# EasyEDA Pro project board.epro

# Schematic Schematic1
Board Name: Board1; Create Date: 2026-04-13; Page Name: P1; Project Name: kbdthing; Schematic Name: Schematic1; Update Date: 2026-05-21; Company: EasyEDA.com; Page Size: A4; Version: V1.0
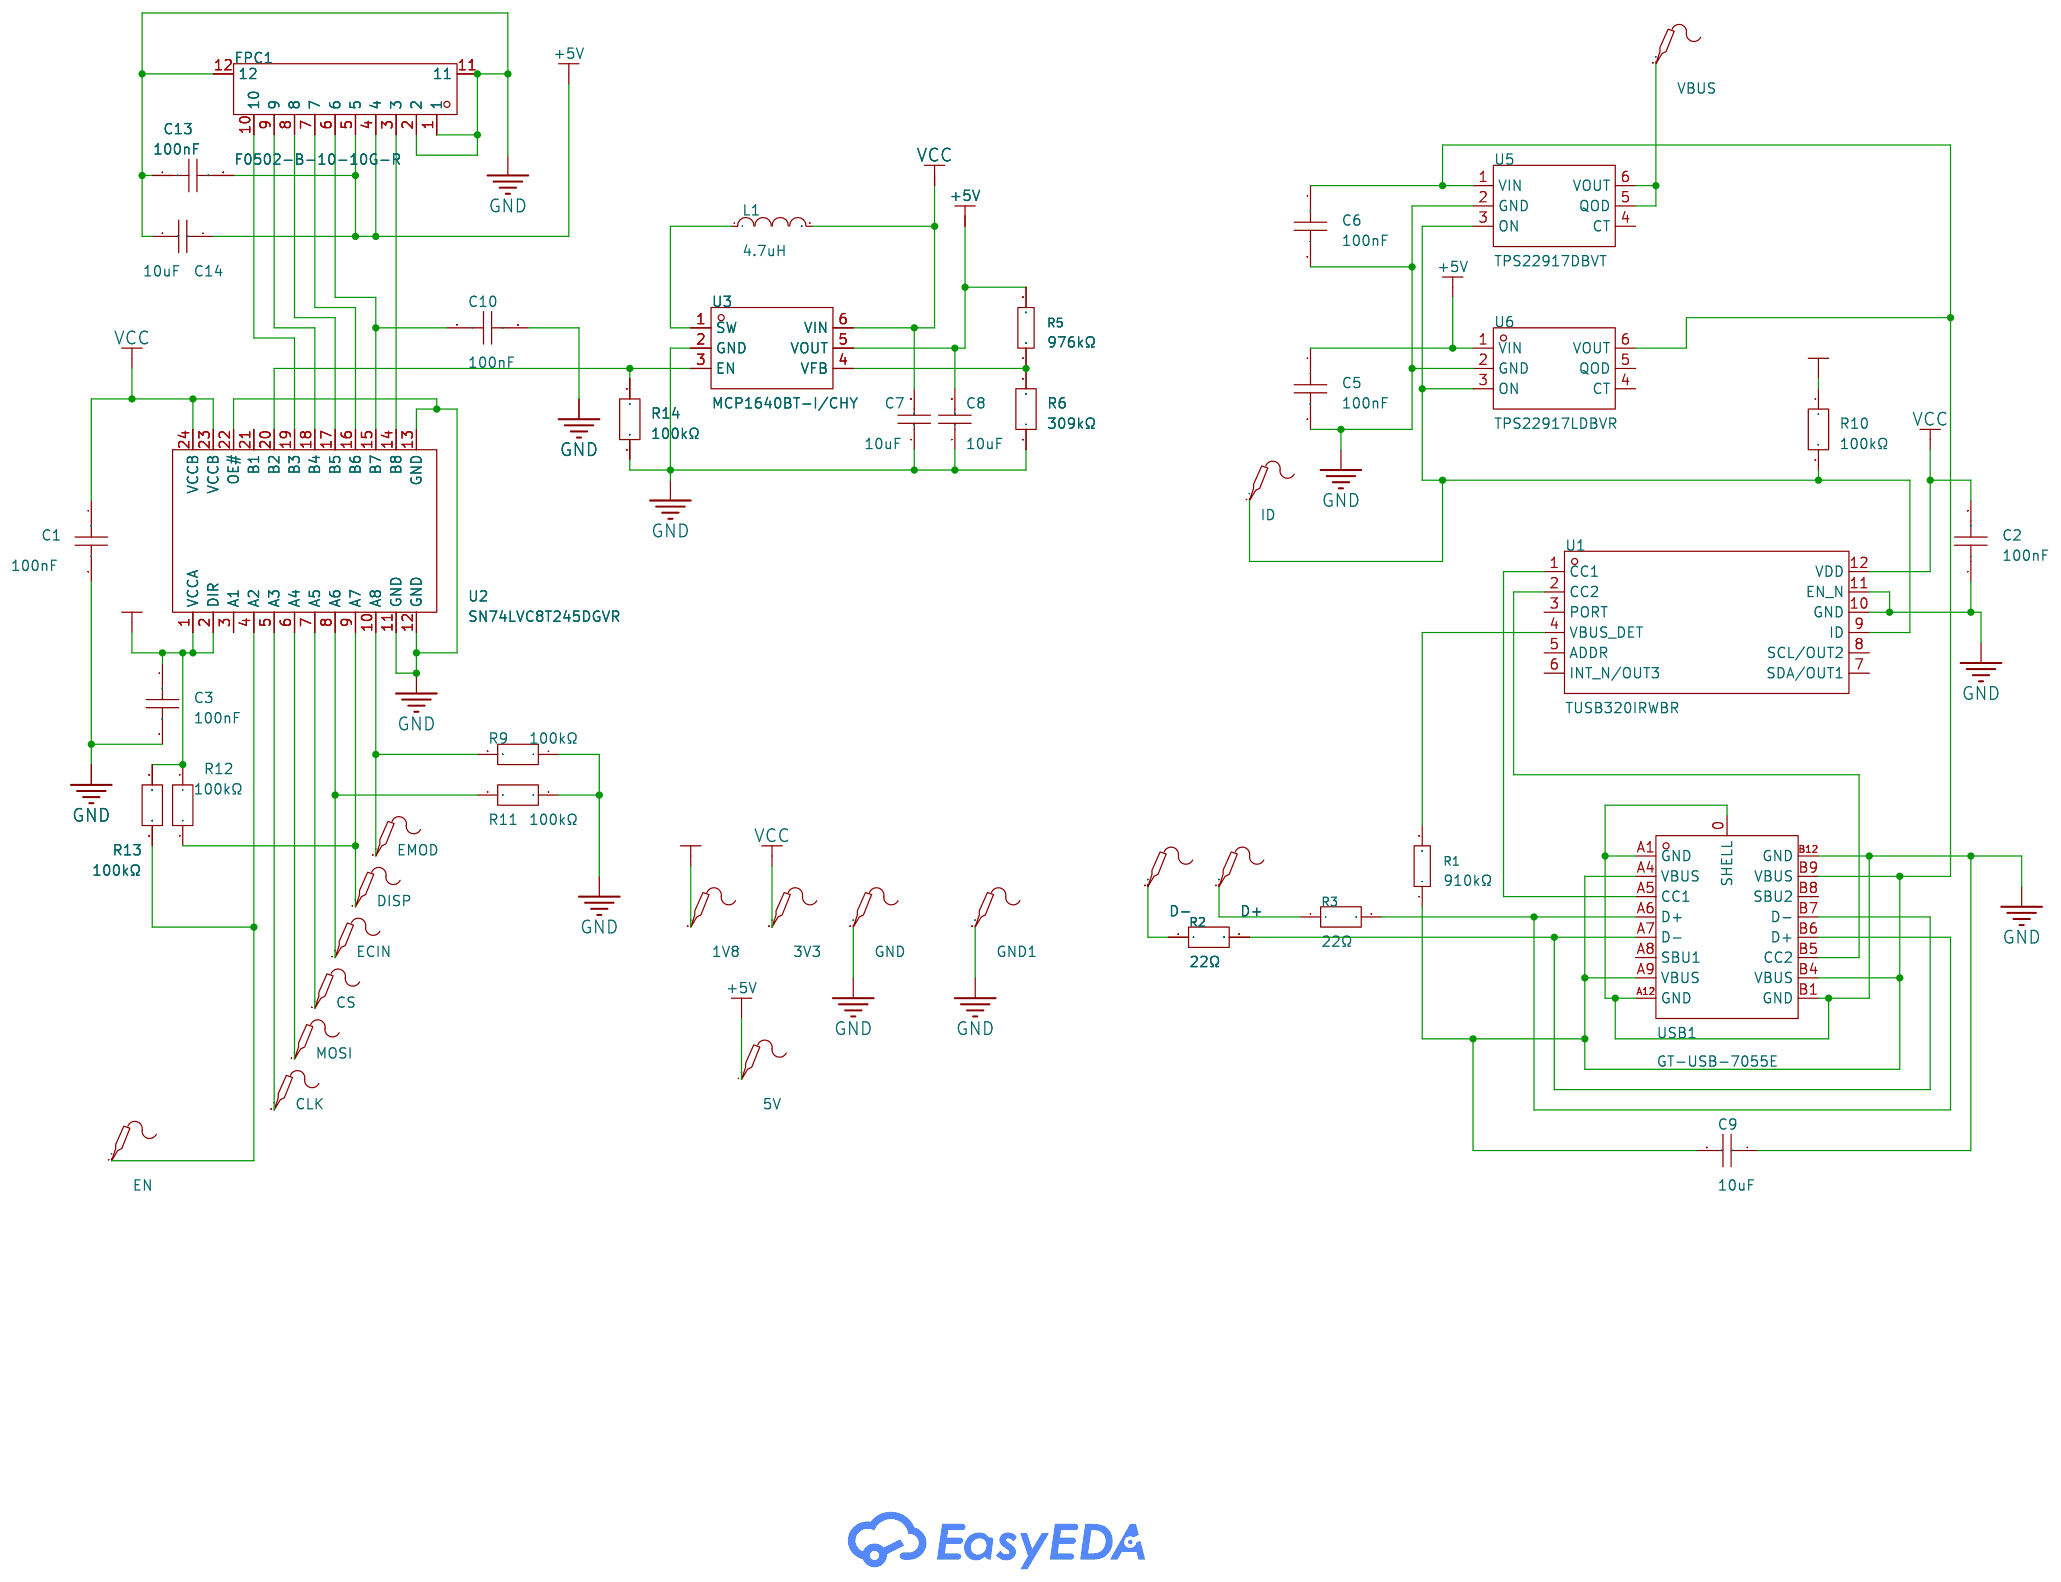
[diagram p0: schematic sheet]

## Parts
1V8  -  [TESTPOINT-SMD_1P-BD1.0-H5.5]
3V3  -  [TESTPOINT-SMD_1P-BD1.0-H5.5]
5V  -  [TESTPOINT-SMD_1P-BD1.0-H5.5]
C1  100nF  [C0402]
C2  100nF  [C0402]
C3  100nF  [C0402]
C5  100nF  [C0402]
C6  100nF  [C0402]
C7  10uF  [C0402]
C8  10uF  [C0402]
C9  10uF  [C0402]
C10  100nF  [C0402]
C13  100nF  [C0402]
C14  10uF  [C0402]
CLK  -  [TESTPOINT-SMD_1P-BD1.0-H5.5]
CS  -  [TESTPOINT-SMD_1P-BD1.0-H5.5]
D+  -  [TESTPOINT-SMD_1P-BD1.0-H5.5]
D-  -  [TESTPOINT-SMD_1P-BD1.0-H5.5]
DISP  -  [TESTPOINT-SMD_1P-BD1.0-H5.5]
ECIN  -  [TESTPOINT-SMD_1P-BD1.0-H5.5]
EMOD  -  [TESTPOINT-SMD_1P-BD1.0-H5.5]
EN  -  [TESTPOINT-SMD_1P-BD1.0-H5.5]
FPC1  F0502-B-10-10G-R  [FPC-SMD_F0502-B-10-10G-R]
GND  -  [TESTPOINT-SMD_1P-BD1.0-H5.5]
GND1  -  [TESTPOINT-SMD_1P-BD1.0-H5.5]
ID  -  [TESTPOINT-SMD_1P-BD1.0-H5.5]
L1  4.7uH  [IND-SMD_L4.0-W4.0_FNR40XXS]
MOSI  -  [TESTPOINT-SMD_1P-BD1.0-H5.5]
R1  910kΩ  [R0402]
R2  22Ω  [R0402]
R3  22Ω  [R0402]
R5  976kΩ  [R0402]
R6  309kΩ  [R0402]
R9  100kΩ  [R0402]
R10  100kΩ  [R0402]
R11  100kΩ  [R0402]
R12  100kΩ  [R0402]
R13  100kΩ  [R0402]
R14  100kΩ  [R0402]
U1  TUSB320IRWBR  [X2QFN-12_L1.6-W1.6-P0.40-TL]
U2  SN74LVC8T245DGVR  [TVSOP-24_L5.0-W4.4-P0.40-LS6.4-BL]
U3  MCP1640BT-I/CHY  [SOT-23-6_L2.9-W1.6-P0.95-LS2.8-BR]
U5  TPS22917DBVT  [SOT-23-6_L2.9-W1.6-P0.95-LS2.8-BR]
U6  TPS22917LDBVR  [SOT-23-6_L2.9-W1.6-P0.95-LS2.8-BR]
USB1  GT-USB-7055E  [USB-C-SMD_GT-USB-7055E]
VBUS  -  [TESTPOINT-SMD_1P-BD1.0-H5.5]

## Library data of the parts
1V8 3V3 5V CLK CS D+ D- DISP ECIN EMOD EN GND GND1 ID MOSI VBUS = Test-Point: Test Point 测试点; Check: false
C1-C3 C5 C6 C10 C13 = CL05B104KO5NNNC: Capacitance:100nF Tolerance:±10% Tolerance:±10% Voltage Rating:16V Temperature Coefficient:X7R; LCSC Part Name: 100nF ±10% 16V; Supplier Part: C1525; Manufacturer: SAMSUNG(三星); Supplier Footprint: 0402; JLCPCB Part Class: Basic Part; Datasheet: https://item.szlcsc.com/datasheet/CL05B104KO5NNNC/1877.html; Supplier: LCSC; Tolerance: ±10%; Voltage Rating: 16V; Temperature Coefficient: X7R
C7-C9 C14 = CL05A106MQ5NUNC: Capacitance:10uF Tolerance:±20% Tolerance:±20% Voltage Rating:6.3V Temperature Coefficient:X5R; LCSC Part Name: 10uF ±20% 6.3V; Supplier Part: C15525; Manufacturer: SAMSUNG(三星); Supplier Footprint: 0402; JLCPCB Part Class: Basic Part; Datasheet: https://item.szlcsc.com/datasheet/CL05A106MQ5NUNC/16204.html; Supplier: LCSC; Tolerance: ±20%; Voltage Rating: 6.3V; Temperature Coefficient: X5R
FPC1 = F0502-B-10-10G-R: Locking Feature:Hinged Lid Contact Type:Bottom Contact Number of Contacts:10P Pitch:0.5mm Mounting Type:Surface Mount, Right Angle FFC, FCB Thickness:0.3mm FFC, FCB Thickness:0.3mm Height Above Board:1mm Contact Material:Phosphor Bronze Contact Plating:Ti; LCSC Part Name: 翻盖式 下接 P数:10P 间距:0.5mm; Supplier Part: C512912; Manufacturer: XFCN(兴飞); Supplier Footprint: SMD,P=0.5mm,卧贴; JLCPCB Part Class: Extended Part; Datasheet: https://item.szlcsc.com/datasheet/F0502-B-10-10G-R/528193.html; Supplier: LCSC; Locking Feature: Hinged Lid; Contact Type: Bottom Contact; Number of Contacts: 10P; Pitch: 0.5mm; Mounting Type: Surface Mount, Right Angle; FFC, FCB Thickness: 0.3mm; Height Above Board: 1mm; Contact Material: Phosphor Bronze; Contact Plating: Tin; Operating Temperature: -25℃~+85℃; Rated Voltage (Max): 50V; Current Rating (Max): 400mA
L1 = FNR4030S4R7MT: Inductance:4.7uH Tolerance:±20% Tolerance:±20% Current Rating:2.3A Current - Saturation(Isat):3.2A DC Resistance(DCR):78mΩ Type:Magnetic Core Shielded Winding Alloy Inductor; LCSC Part Name: 4.7uH ±20% 3.2A; Supplier Part: C167874; Manufacturer: cjiang(长江微电); Supplier Footprint: SMD,4x4mm; JLCPCB Part Class: Extended Part; Datasheet: https://atta.szlcsc.com/upload/public/pdf/source/20190327/C167925_9EFF0AABC4CA629C2CC95961DBF7D39D.pdf; Supplier: LCSC; Tolerance: ±20%; Current Rating: 2.3A; Current - Saturation(Isat): 3.2A; DC Resistance(DCR): 78mΩ; Type: Magnetic Core Shielded Winding Alloy Inductor
R1 = 0402WGF9103TCE: Type:Thick Film Resistor Resistance:910kΩ Tolerance:±1% Tolerance:±1% Power(Watts):62.5mW Voltage-Supply(Max):50V Temperature Coefficient:±100ppm/℃ Temperature Coefficient:±100ppm/℃ Operating Temperature:-55℃~+155℃ Operating Temperature:-55℃~+155℃; LCSC Part Name: 910kΩ ±1% 62.5mW 厚膜电阻; Supplier Part: C25800; Manufacturer: UNI-ROYAL(厚声); Supplier Footprint: 0402; JLCPCB Part Class: Extended Part; Datasheet: https://item.szlcsc.com/datasheet/0402WGF9103TCE/26543.html; Supplier: LCSC; Type: Thick Film Resistor; Tolerance: ±1%; Power(Watts): 62.5mW; Voltage-Supply(Max): 50V; Temperature Coefficient: ±100ppm/℃; Operating Temperature: -55℃~+155℃
R2 R3 = FRC0402J220 TS: Type:Thick Film Resistor Resistance:22Ω Tolerance:±5% Tolerance:±5% Power(Watts):62.5mW Voltage-Supply(Max):50V Temperature Coefficient:±100ppm/℃ Temperature Coefficient:±100ppm/℃ Operating Temperature:-55℃~+155℃ Operating Temperature:-55℃~+155℃; LCSC Part Name: 22Ω ±5% 62.5mW 厚膜电阻; Supplier Part: C2906914; Manufacturer: FOJAN(富捷); Supplier Footprint: 0402; JLCPCB Part Class: Extended Part; Datasheet: https://item.szlcsc.com/datasheet/FRC0402J220%2520TS/3180427.html; Supplier: LCSC; Type: Thick Film Resistor; Tolerance: ±5%; Power(Watts): 62.5mW; Voltage-Supply(Max): 50V; Temperature Coefficient: ±100ppm/℃; Operating Temperature: -55℃~+155℃
R5 = 0402WGF9763TCE: Type:Thick Film Resistor Resistance:976kΩ Tolerance:±1% Tolerance:±1% Power(Watts):62.5mW Voltage-Supply(Max):50V Temperature Coefficient:±100ppm/℃ Temperature Coefficient:±100ppm/℃ Operating Temperature:-55℃~+155℃ Operating Temperature:-55℃~+155℃; LCSC Part Name: 976kΩ ±1% 62.5mW 厚膜电阻; Supplier Part: C25802; Manufacturer: UNI-ROYAL(厚声); Supplier Footprint: 0402; JLCPCB Part Class: Extended Part; Datasheet: https://item.szlcsc.com/datasheet/0402WGF9763TCE/26545.html; Supplier: LCSC; Type: Thick Film Resistor; Tolerance: ±1%; Power(Watts): 62.5mW; Voltage-Supply(Max): 50V; Temperature Coefficient: ±100ppm/℃; Operating Temperature: -55℃~+155℃
R6 = FRC0402F3093TS: Type:Thick Film Resistor Resistance:309kΩ Tolerance:±1% Tolerance:±1% Power(Watts):62.5mW Voltage-Supply(Max):50V Temperature Coefficient:±100ppm/℃ Temperature Coefficient:±100ppm/℃ Operating Temperature:-55℃~+155℃ Operating Temperature:-55℃~+155℃; LCSC Part Name: 309kΩ ±1% 62.5mW 厚膜电阻; Supplier Part: C5713270; Manufacturer: FOJAN(富捷); Supplier Footprint: 0402; JLCPCB Part Class: Extended Part; Supplier: LCSC; Type: Thick Film Resistor; Tolerance: ±1%; Power(Watts): 62.5mW; Voltage-Supply(Max): 50V; Temperature Coefficient: ±100ppm/℃; Operating Temperature: -55℃~+155℃
R9-R14 = FRC0402F1003TS: Type:Thick Film Resistor Resistance:100kΩ Tolerance:±1% Tolerance:±1% Power(Watts):62.5mW Voltage-Supply(Max):50V Temperature Coefficient:±100ppm/℃ Temperature Coefficient:±100ppm/℃ Operating Temperature:-55℃~+155℃ Operating Temperature:-55℃~+155℃; LCSC Part Name: 100kΩ ±1% 62.5mW 厚膜电阻; Supplier Part: C2906859; Manufacturer: FOJAN(富捷); Supplier Footprint: 0402; JLCPCB Part Class: Extended Part; Supplier: LCSC; Type: Thick Film Resistor; Tolerance: ±1%; Power(Watts): 62.5mW; Voltage-Supply(Max): 50V; Temperature Coefficient: ±100ppm/℃; Operating Temperature: -55℃~+155℃
U1 = TUSB320IRWBR: Interface:I2C；GPIO Data Rate:- Voltage - Supply:2.7V~5V Voltage - Supply:2.7V~5V Operating Temperature:-40℃~+85℃ Operating Temperature:-40℃~+85℃ Supply Current:100uA Quiescent Supply Current:100uA Features:-; LCSC Part Name: TUSB320 USB Type-C配置通道逻辑和端口控制; Supplier Part: C80170; Manufacturer: TI(德州仪器); Supplier Footprint: X2-QFN-12(1.6x1.6); JLCPCB Part Class: Extended Part; Datasheet: https://www.ti.com/cn/lit/gpn/tusb320; Supplier: LCSC; Interface: I2C；GPIO; Voltage - Supply: 2.7V~5V; Operating Temperature: -40℃~+85℃; Supply Current: 100uA; Quiescent Supply Current: 100uA
U2 = SN74LVC8T245DGVR: Channel Type:Bidirectional Voltage - Supply(VCCA):1.65V~5.5V Voltage - Supply(VCCA):1.65V~5.5V Voltage - Supply(VCCB):1.65V~5.5V Voltage - Supply(VCCB):1.65V~5.5V Number of Circuits:8 Output Type:Tri-State Operating Temperature:-40℃~+85℃ Operating Tempera; LCSC Part Name: 具备可配置电压转换和三态输出功能的8位双电源总线收发器; Supplier Part: C364886; Manufacturer: TI(德州仪器); Supplier Footprint: TVSOP-24; JLCPCB Part Class: Extended Part; Datasheet: https://www.ti.com/cn/lit/gpn/sn74lvc8t245; Supplier: LCSC; Channel Type: Bidirectional; Voltage - Supply(VCCA): 1.65V~5.5V; Voltage - Supply(VCCB): 1.65V~5.5V; Number of Circuits: 8; Output Type: Tri-State; Operating Temperature: -40℃~+85℃; Features: Power-Off Protection
U3 = MCP1640BT-I/CHY: Function:Boost Voltage - Supply:800mV~5.5V Voltage - Supply:800mV~5.5V Output Voltage:2V~5.5V Output Voltage:2V~5.5V Output Current:350mA Frequency - Switching:500kHz Frequency - Switching:500kHz Operating Temperature:-40℃~+125℃@(TJ) Operating Temperature; LCSC Part Name: 具备真输出断开或输入/输出旁路选项的 0.65V 启动同步升压调节器; Supplier Part: C478087; Manufacturer: MICROCHIP(美国微芯); Supplier Footprint: SOT-23-6; JLCPCB Part Class: Extended Part; Datasheet: https://item.szlcsc.com/datasheet/MCP1640BT-I%252FCHY/485396.html; Supplier: LCSC; Function: Boost; Voltage - Supply: 800mV~5.5V; Output Voltage: 2V~5.5V; Output Current: 350mA; Frequency - Switching: 500kHz; Operating Temperature: -40℃~+125℃@(TJ); Synchronous Rectifier: Yes; Number of Outputs: 1; Topology: Boost; Quiescent Current: 19uA; Switch tube (built-in/external): Built-In; Output Type: Adjustable
U5 = TPS22917DBVT: Type:Load Switch Number of Channels:1 Control Input Logic:Active High Maximum Continuous Current:2A Voltage - Supply:1V~5.5V Voltage - Supply:1V~5.5V RDS(on):80mΩ Operating Temperature	-:-40℃~+125℃ Operating Temperature	-:-40℃~+125℃ Features:-; LCSC Part Name: 1V至5.5V、2A、超低泄漏负载开关; Supplier Part: C2680344; Manufacturer: TI(德州仪器); Supplier Footprint: SOT-23-6; JLCPCB Part Class: Extended Part; Datasheet: https://www.ti.com/cn/lit/gpn/tps22917; Supplier: LCSC; Type: Load Switch; Number of Channels: 1; Control Input Logic: Active High; Maximum Continuous Current: 2A; Voltage - Supply: 1V~5.5V; RDS(on): 80mΩ; Operating Temperature	-: -40℃~+125℃
U6 = TPS22917LDBVR: Type:Load Switch Number of Channels:1 Control Input Logic:Active Low Maximum Continuous Current:2A Voltage - Supply:0V~5.5V Voltage - Supply:0V~5.5V RDS(on):220mΩ Operating Temperature	-:-40℃~+125℃ Operating Temperature	-:-40℃~+125℃ Features:-; LCSC Part Name: 1V至5.5V、2A、超低泄漏负载开关; Supplier Part: C3235537; Manufacturer: TI(德州仪器); Supplier Footprint: SOT-23-6; JLCPCB Part Class: Extended Part; Datasheet: https://www.ti.com/cn/lit/gpn/tps22917; Supplier: LCSC; Type: Load Switch; Number of Channels: 1; Control Input Logic: Active Low; Maximum Continuous Current: 2A; Voltage - Supply: 0V~5.5V; RDS(on): 220mΩ; Operating Temperature	-: -40℃~+125℃
USB1 = GT-USB-7055E: Connector Type:Type-C Standard:USB 2.0 Gender:Female Mounting Style:Standing paste Number of Contacts:16P Number of Ports:1 Current Rating - Power (Max):5A Rated Voltage (Max):24V Connect-Disconnect Life:10,000 times Length:5.7mm Core Colour:Black Operati; LCSC Part Name: Type-C 母 立贴; Supplier Part: C7450622; Manufacturer: G-Switch(品赞); Supplier Footprint: SMD; JLCPCB Part Class: Extended Part; Datasheet: https://atta.szlcsc.com/upload/public/pdf/source/20230712/4C2907DAF9E937754FBC45253E388D05.pdf; Supplier: LCSC; Connector Type: Type-C; Standard: USB 2.0; Gender: Female; Mounting Style: Standing paste; Number of Contacts: 16P; Number of Ports: 1; Current Rating - Power (Max): 5A; Rated Voltage (Max): 24V; Connect-Disconnect Life: 10,000 times; Length: 5.7mm; Core Colour: Black; Operating Temperature Range: -40℃~+85℃

## Nets
1V8: 1V8.1 C3.1 R10.1 R12.1 R13.1 U2.1(VCCA) U2.2(DIR)
+5V: 5V.1 C5.1 C8.2 C13.2 C14.1 FPC1.4 FPC1.5 R5.2 U3.5(VOUT) U6.1(VIN)
GND: C1.2 C2.1 C3.2 C5.2 C6.2 C7.1 C8.1 C9.1 C10.2 C13.1 C14.2 FPC1.1 FPC1.2 FPC1.11 FPC1.12 GND.1 GND1.1 R6.1 R9.1 R11.1 R14.2 U1.10(GND) U1.11(EN_N) U2.11(GND) U2.12(GND) U2.13(GND) U2.22(OE#) U3.2(GND) U5.2(GND) U6.2(GND) USB1.0(SHELL) USB1.A1(GND) USB1.A12(GND) USB1.B1(GND) USB1.B12(GND)
VCC: 3V3.1 C1.1 C2.2 C7.2 L1.2 U1.12(VDD) U2.23(VCCB) U2.24(VCCB) U3.6(VIN)
$1N1750: FPC1.3 U2.14(B8)
$1N1756: C10.1 FPC1.6 U2.15(B7)
$1N1763: FPC1.7 U2.16(B6)
$1N1770: FPC1.8 U2.17(B5)
$1N1777: FPC1.9 U2.18(B4)
$1N1783: FPC1.10 U2.19(B3)
$1N2024: ID.1 R10.2 U1.9(ID) U5.3(ON) U6.3(ON)
$1N2098: U1.1(CC1) USB1.A5(CC1)
$1N2107: U1.2(CC2) USB1.B5(CC2)
$1N2158: C6.1 C9.2 R1.1 U5.1(VIN) U6.6(VOUT) USB1.A4(VBUS) USB1.A9(VBUS) USB1.B4(VBUS) USB1.B9(VBUS)
$1N2234: R14.1 U2.20(B2) U3.3(EN)
$1N2668: R1.2 U1.4(VBUS_DET)
$1N3088: EN.1 R13.2 U2.4(A2)
$1N3093: CLK.1 U2.5(A3)
$1N3097: MOSI.1 U2.6(A4)
$1N3142: CS.1 U2.7(A5)
$1N3146: ECIN.1 R11.2 U2.8(A6)
$1N3176: DISP.1 R12.2 U2.9(A7)
$1N3199: EMOD.1 R9.2 U2.10(A8)
$1N3987: D-.1 R2.1
$1N3994: R2.2 USB1.A7(D-) USB1.B7(D-)
$1N3997: D+.1 R3.1
$1N4004: R3.2 USB1.A6(D+) USB1.B6(D+)
$1N4388: U5.5(QOD) U5.6(VOUT) VBUS.1
$1N4633: L1.1 U3.1(SW)
$1N4870: R5.1 R6.2 U3.4(VFB)

Not connected (* = marked no-connect by the designer): U1 3(PORT) 5(ADDR) 6(INT_N/OUT3) 7(SDA/OUT1) 8(SCL/OUT2); U2 3(A1) 21(B1); U5 4(CT); U6 4(CT) 5(QOD); USB1 A8(SBU1) B8(SBU2)

# Board PCB1
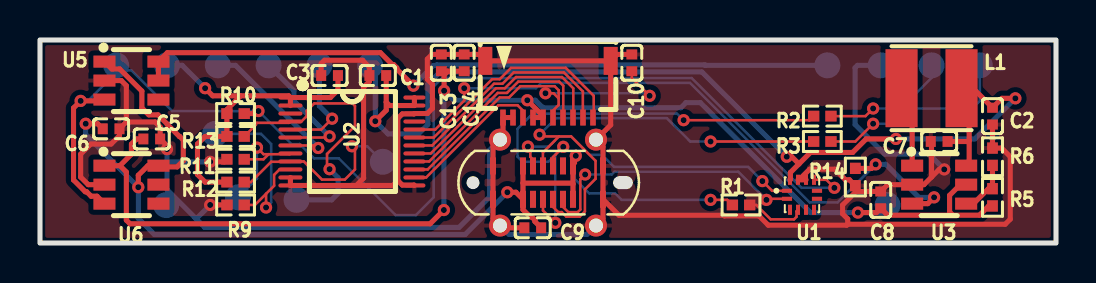
[diagram p1: board, top side]
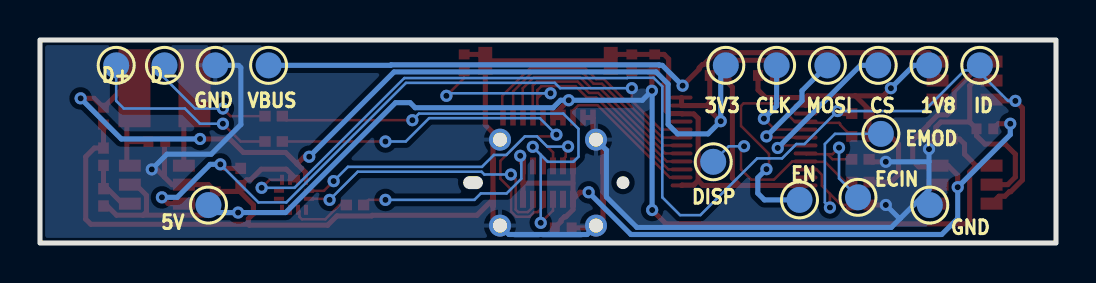
[diagram p2: board, bottom side, seen from below]

Outline 50.8 x 10.16 mm; copper layers: Top Layer, Bottom Layer. Coordinates in mm from the lower left corner of the outline.
Outline path: rectangle 0,10.16 50.8,0
Stack: Top Layer 0.035mm / Dielectric1 1.51mm FR4 er 4.5 / Bottom Layer 0.035mm

## Design rules (mm)
template: JLCPCB Capability(Two Layers Board)
spacing copperThickness1oz (default): track to track 0.102, other pairs 0.152 to 0.3
spacing copperThickness2oz: track to track 0.203, other pairs 0.152 to 0.3
track width copperThickness1oz (default): min 0.127, default 0.254, max 2.54
track width copperThickness2oz: min 0.203, default 0.254, max 2.54
differential pair differentialPair (default): width min 0.127, default 0.254, max 2.54; gap min 0.152, default 0.152
via viaSize (default): diameter min 0.5, default 0.61, max 10; hole min 0.3, default 0.305, max 6.3

## Placement (name value [footprint] x y rotation side)
1V8  -  [TESTPOINT-SMD_1P-BD1.0-H5.5]  6.35 8.89 180 bottom
3V3  -  [TESTPOINT-SMD_1P-BD1.0-H5.5]  16.51 8.89 0 bottom
5V  -  [TESTPOINT-SMD_1P-BD1.0-H5.5]  42.38 1.9 180 bottom
C1  100nF  [C0402]  16.89 8.38 180 top
C2  100nF  [C0402]  47.62 6.35 90 top
C3  100nF  [C0402]  14.48 8.38 180 top
C5  100nF  [C0402]  5.59 5.21 0 top
C6  100nF  [C0402]  3.56 5.72 0 top
C7  10uF  [C0402]  44.96 5.08 0 top
C8  10uF  [C0402]  42.04 2.16 270 top
C9  10uF  [C0402]  24.64 0.76 0 top
C10  100nF  [C0402]  29.59 9.02 90 top
C13  100nF  [C0402]  20.07 9.02 270 top
C14  10uF  [C0402]  21.21 9.02 90 top
CLK  -  [TESTPOINT-SMD_1P-BD1.0-H5.5]  13.97 8.89 180 bottom
CS  -  [TESTPOINT-SMD_1P-BD1.0-H5.5]  8.89 8.89 180 bottom
D+  -  [TESTPOINT-SMD_1P-BD1.0-H5.5]  46.99 8.89 0 bottom
D-  -  [TESTPOINT-SMD_1P-BD1.0-H5.5]  44.58 8.89 180 bottom
DISP  -  [TESTPOINT-SMD_1P-BD1.0-H5.5]  17.14 4.06 0 bottom
ECIN  -  [TESTPOINT-SMD_1P-BD1.0-H5.5]  9.9 2.29 180 bottom
EMOD  -  [TESTPOINT-SMD_1P-BD1.0-H5.5]  8.76 5.46 0 bottom
EN  -  [TESTPOINT-SMD_1P-BD1.0-H5.5]  12.83 2.16 180 bottom
FPC1  F0502-B-10-10G-R  [FPC-SMD_F0502-B-10-10G-R]  25.4 7.7 180 top
GND  -  [TESTPOINT-SMD_1P-BD1.0-H5.5]  6.31 1.9 180 bottom
GND#2  -  [TESTPOINT-SMD_1P-BD1.0-H5.5]  42.04 8.89 0 bottom
ID  -  [TESTPOINT-SMD_1P-BD1.0-H5.5]  3.81 8.89 180 bottom
L1  4.7uH  [IND-SMD_L4.0-W4.0_FNR40XXS]  44.58 7.75 0 top
MOSI  -  [TESTPOINT-SMD_1P-BD1.0-H5.5]  11.43 8.89 180 bottom
R1  910kΩ  [R0402]  35.05 1.91 0 top
R2  22Ω  [R0402]  39.12 6.35 180 top
R3  22Ω  [R0402]  39.12 5.08 180 top
R5  976kΩ  [R0402]  47.62 2.29 270 top
R6  309kΩ  [R0402]  47.62 4.32 270 top
R9  100kΩ  [R0402]  9.78 1.91 0 top
R10  100kΩ  [R0402]  9.78 6.48 0 top
R11  100kΩ  [R0402]  9.78 4.19 0 top
R12  100kΩ  [R0402]  9.78 3.05 0 top
R13  100kΩ  [R0402]  9.78 5.33 0 top
R14  100kΩ  [R0402]  40.77 3.3 270 top
U1  TUSB320IRWBR  [X2QFN-12_L1.6-W1.6-P0.40-TL]  38.1 2.41 0 top
U2  SN74LVC8T245DGVR  [TVSOP-24_L5.0-W4.4-P0.40-LS6.4-BL]  15.62 5.08 270 top
U3  MCP1640BT-I/CHY  [SOT-23-6_L2.9-W1.6-P0.95-LS2.8-BR]  44.96 2.92 180 top
U5  TPS22917DBVT  [SOT-23-6_L2.9-W1.6-P0.95-LS2.8-BR]  4.57 8.13 180 top
U6  TPS22917LDBVR  [SOT-23-6_L2.9-W1.6-P0.95-LS2.8-BR]  4.57 2.92 180 top
USB1  GT-USB-7055E  [USB-C-SMD_GT-USB-7055E]  25.4 3.02 0 top
VBUS  -  [TESTPOINT-SMD_1P-BD1.0-H5.5]  39.37 8.89 180 bottom

## Footprints (pads in the part's own frame, mm; a bottom-side part is the same pattern mirrored in y, then rotated)
C0402
  rect 0.5x0.54 smd: 1(-0.42,0) 2(0.42,0)
FPC-SMD_F0502-B-10-10G-R
  rect 0.28x0.8 smd: 1(2.25,1.417) 2(1.75,1.417) 3(1.25,1.417) 4(0.75,1.417) 5(0.25,1.417) 6(-0.25,1.417) 7(-0.75,1.417) 8(-1.25,1.417) 9(-1.75,1.417) 10(-2.25,1.417)
  rect 0.7x1.4 smd: 11(-3.135,-1.417) 12(3.135,-1.417)
IND-SMD_L4.0-W4.0_FNR40XXS
  rect 1.6x3.9 smd: 1(-1.5,0) 2(1.5,0)
R0402
  rect 0.566x0.54 smd: 1(-0.433,0) 2(0.433,0)
SOT-23-6_L2.9-W1.6-P0.95-LS2.8-BR
  rect 1.1x0.6 smd: 1(1.35,-0.95) 2(1.35,0) 3(1.35,0.95) 4(-1.35,0.95) 5(-1.35,0) 6(-1.35,-0.95)
TESTPOINT-SMD_1P-BD1.0-H5.5
  round 1.3 smd: 1(0,0)
TVSOP-24_L5.0-W4.4-P0.40-LS6.4-BL
  oval 0.2x1.2 smd: 1(-2.2,-3.1) 2(-1.8,-3.1) 3(-1.4,-3.1) 4(-1,-3.1) 5(-0.6,-3.1) 6(-0.2,-3.1) 7(0.2,-3.1) 8(0.6,-3.1) 9(1,-3.1) 10(1.4,-3.1) 11(1.8,-3.1) 12(2.2,-3.1)
  oval 0.2x1.1 smd: 13(2.2,3.1) 14(1.8,3.1) 15(1.4,3.1) 16(1,3.1) 17(0.6,3.1) 18(0.2,3.1) 19(-0.2,3.1) 20(-0.6,3.1) 21(-1,3.1) 22(-1.4,3.1) 23(-1.8,3.1) 24(-2.2,3.1)
USB-C-SMD_GT-USB-7055E
  round 1.1 hole 0.7: 0(-2.4,2.15) 0(-2.4,-2.15) 0(2.4,2.15) 0(2.4,-2.15)
  rect 0.3x0.85 smd: A1(-2.75,0.835) A4(-1.25,0.835) A5(-0.75,0.835) A6(-0.25,0.835) A7(0.25,0.835) A8(0.75,0.835) A9(1.25,0.835) A12(2.75,0.835) B1(2.75,-0.835) B4(1.25,-0.835) B5(0.75,-0.835) B6(0.25,-0.835) B7(-0.25,-0.835) B8(-0.75,-0.835) B9(-1.25,-0.835) B12(-2.75,-0.835)
X2QFN-12_L1.6-W1.6-P0.40-TL
  rect 0.505x0.2 smd: 1(-0.75,0.2) 2(-0.75,-0.2) 7(0.75,-0.2) 8(0.75,0.2)
  rect 0.2x0.505 smd: 3(-0.6,-0.75) 4(-0.2,-0.75) 5(0.2,-0.75) 6(0.6,-0.75) 9(0.6,0.75) 10(0.2,0.75) 11(-0.2,0.75) 12(-0.6,0.75)

## Nets
As in the schematic, except:
GND: C1.2 C2.1 C3.2 C5.2 C6.2 C7.1 C8.1 C9.1 C10.2 C13.1 C14.2 FPC1.1 FPC1.2 FPC1.11 FPC1.12 GND.1 GND#2.1 R6.1 R9.1 R11.1 R14.2 U1.10 U1.11 U2.11 U2.12 U2.13 U2.22 U3.2 U5.2 U6.2 USB1.0 USB1.A1 USB1.A12 USB1.B1 USB1.B12

Pads without a net: U1 3 5 6 7 8; U2 3 21; U5 4; U6 4 5; USB1 A8 B8

## Via types
v1: diameter 0.61, hole 0.305, Top Layer to Bottom Layer, 45 vias

## Routing (per net, layer and track width the routed paths; a pad name or vN(x,y) marks a point on that pad's centre or on a via; arc(x,y) is an arc through that point)
1V8: length 17.6
  Top Layer w0.254: R12.1 8.25,3.05 7.87,3.43 7.87,4.95 8.25,5.33 R13.1 R10.1 9.35,6.68 10.03,7.37 ; 10.03,7.37 12.44,7.37 12.52,7.28 ; 10.03,7.37 8.64,7.37 v1(8.25,7.75) ; 12.52,7.28 12.52,6.88 ; 12.52,7.28 14.52,7.28 14.9,7.66 C3.1
  Bottom Layer w0.254: v1(8.25,7.75) 7.11,8.89 1V8.1
+5V: length 66.1
  Top Layer w0.254: C14.1 20.39,8.6 20.37,8.58 ; 20.37,8.58 20.35,8.6 C13.2 ; 20.37,8.58 20.21,8.41 v1(20.21,7.62) ; 24.65,6.28 25.15,6.28 25.15,6.36 v1(24.37,7.14) ; 4,3.87 4.57,4.44 4.57,4.95 4.83,5.21 C5.1 ; 4,3.87 U6.1 ; 4,3.87 4.32,3.55 4.32,1.14 4.5,0.96 19.51,0.96 v1(20.19,1.65) ; 45.64,1.39 45.48,1.56 45.48,2.39 46.01,2.92 U3.5 ; 45.64,1.39 42.38,1.39 C8.2 41.82,1.52 v1(40.89,1.52) ; 45.64,1.39 46.97,1.39 47.43,1.85 R5.2
  Bottom Layer w0.254: v1(20.19,1.65) 20.19,7.61 v1(20.21,7.62) 20.68,7.14 v1(24.37,7.14) 24.77,7.14 25.15,6.77 32.04,6.77 32.3,7.02 33.02,7.02 38.52,1.52 v1(40.89,1.52) 42,1.52 5V.1
GND: length 143.6
  Top Layer w0.254: U5.2 4.06,8.13 4.32,7.87 4.32,6.06 ; FPC1.11 28.53,5.91 USB1.0 28.15,4.82 USB1.A12 USB1.B1 ; FPC1.11 22.26,9.11 21.94,9.44 C14.2 C13.1 19.6,9.44 19.37,9.21 19.37,8.19 19.62,7.94 19.62,6.73 19.37,6.48 U2.22 18.7,6.46 18.11,6.46 17.89,6.24 17.89,3.12 ; FPC1.11 28.86,9.44 C10.2 ; 40.38,0.94 40.38,1.21 40.13,1.46 40.13,1.9 40.81,2.58 C8.1 42.38,2.92 U3.2 44.2,2.92 44.58,3.3 ; 40.38,0.94 48.26,0.94 48.51,1.19 48.51,4.32 48.08,4.75 R6.1 C2.1 ; 40.38,0.94 40.34,0.89 36.41,0.89 35.95,1.36 34.22,1.36 34.19,1.39 28.95,1.39 USB1.B1 ; 17.89,3.12 17.65,2.88 15.81,2.88 ; 17.89,3.12 18.11,2.9 18.7,2.9 U2.13 ; v1(8.51,4.06) 9.22,4.06 R11.1 ; C9.1 23.11,0.76 USB1.0 22.65,1.22 USB1.B12 USB1.A1 22.65,4.82 USB1.0 23.15,5.32 23.15,6.28 23.65,6.28 ; USB1.B1 28.15,1.22 USB1.0 ; 15.81,2.88 16.18,3.25 16.18,7.8 16.47,8.09 C1.2 16.47,8.8 16.13,9.14 14.22,9.14 14.06,8.98 C3.2 ; 15.81,2.88 12.52,2.88 12.52,3.28 ; 4.32,6.06 5.75,6.06 6.01,5.8 C5.2 6.35,4.86 v1(6.35,4.7) ; 4.32,6.06 C6.2 3.98,5.37 3.56,4.95 2.54,4.95 2.03,4.44 2.03,3.3 2.41,2.92 U6.2 ; 37.95,3.16 U1.10 ; 37.95,3.16 U1.11 ; 37.95,3.16 38.48,3.69 39.74,3.69 40.27,3.16 40.47,3.16 R14.2 ; C7.1 44.58,5.04 44.58,3.3 ; v1(45.21,3.68) 44.96,3.68 44.58,3.3 ; v1(8.51,1.91) R9.1
  Bottom Layer w0.254: USB1.0 23.45,0.43 27.35,0.43 USB1.0 ; v1(8.51,1.91) 7.86,1.25 7.76,1.25 ; 6.35,4.06 6.35,2.67 7.76,1.25 ; 6.35,4.06 v1(6.35,4.7) ; 6.35,4.06 v1(8.51,4.06) ; 7.76,1.25 8.23,0.78 20.96,0.78 22.48,2.31 22.48,4.65 USB1.0 ; v1(45.21,3.68) 44.45,4.44 42.24,4.44 40.76,5.93 40.76,8.77 40.87,8.89 GND#2.1
VCC: length 54.8
  Top Layer w0.254: U3.6 46.46,4.02 46.46,5.12 ; U1.12 37.52,3.18 37.52,3.53 37.95,3.96 ; 37.95,3.96 38.52,4.53 40.63,4.53 41.31,5.21 v1(42.8,5.21) ; 37.95,3.96 37.59,4.32 v1(37.34,4.32) ; v1(48.77,7.24) 48.09,7.24 C2.2 46.65,7.75 L1.2 46.46,7.37 46.46,5.12 ; 46.46,5.12 46.41,5.08 C7.2 ; U2.24 U2.23 17.48,6.88 17.31,7.05 ; v1(16.76,6.1) 17.31,6.64 17.31,7.05 ; 17.31,7.05 17.31,8.38
  Bottom Layer w0.254: 3V3.1 16.76,8.64 v1(16.76,6.1) 17.4,5.46 18.92,5.46 19.39,5.93 19.39,7.96 20,8.56 33.1,8.56 v1(37.34,4.32) ; v1(48.77,7.24) 46.74,5.21 v1(42.8,5.21)
$1N1750: length 7.4
  Top Layer w0.127: U2.14 19.31,3.28 22.92,6.89 23.88,6.89 24.15,6.62 24.15,6.28
$1N1756: length 18.1
  Top Layer w0.127: C10.1 29.59,8.25 v1(30.48,7.37) ; 25.93,7.24 25.93,6.91 25.65,6.62 25.65,6.28 ; 25.93,7.24 25.93,7.64 25.73,7.85 24.02,7.85 23.45,7.28 22.99,7.28 19.38,3.68 U2.15 ; 25.93,7.24 25.68,7.49 v1(25.27,7.49)
  Bottom Layer w0.127: v1(25.27,7.49) 30.35,7.49 v1(30.48,7.37)
$1N1763: length 10.8
  Top Layer w0.127: 26.15,6.28 26.16,6.29 26.16,7.87 25.96,8.08 23.91,8.08 23.35,7.51 22.89,7.51 19.46,4.08 U2.16
$1N1770: length 11.2
  Top Layer w0.127: U2.17 19.53,4.48 22.79,7.74 23.24,7.74 23.8,8.31 26.1,8.31 26.66,7.74 26.66,6.29 26.65,6.28
$1N1777: length 11.6
  Top Layer w0.127: 27.15,6.28 27.14,6.29 27.14,7.58 26.19,8.53 23.69,8.53 23.12,7.97 22.7,7.97 19.61,4.88 U2.18
$1N1783: length 12.1
  Top Layer w0.127: U2.19 19.69,5.28 22.61,8.2 22.99,8.2 23.55,8.76 26.29,8.76 27.69,7.37 27.69,6.31 27.65,6.28
$1N2024: length 59
  Top Layer w0.127: U1.9 39.32,3.16 v1(39.72,2.76)
  Top Layer w0.254: U5.3 3.16,7.11 v1(2.03,7.11) 1.68,6.76 1.68,3.15 2.27,2.56 2.33,2.56 2.56,2.34 2.85,2.34 U6.3 ; v1(10.92,6.6) 10.79,6.48 R10.2
  Bottom Layer w0.127: v1(2.03,7.11) 2.4,7.11 3.92,8.64 4.57,8.64 6.6,6.6 v1(10.92,6.6) 12.57,4.95 12.98,4.95 13.7,4.24 14.94,4.24 17.78,1.4 18.8,1.4 19.69,2.29 19.69,7.84 20.12,8.27 21.42,8.27 21.44,8.25 32.58,8.25 38.07,2.76 v1(39.72,2.76)
$1N2098: length 15.4
  Top Layer w0.127: v1(36.12,3.1) 36.6,2.61 U1.1 ; USB1.A5 24.65,4.18 24.52,4.31 24.52,4.71 v1(24.4,4.83)
  Bottom Layer w0.127: v1(24.4,4.83) 25.44,4.83 25.95,5.33 26.56,5.33 27.48,4.41 28.1,4.41 28.7,3.81 35.41,3.81 v1(36.12,3.1)
$1N2107: length 14
  Top Layer w0.127: U1.2 36.38,2.21 v1(36.32,2.16) ; v1(27.26,3.43) 27.02,3.19 27.02,1.67 26.89,1.55 26.41,1.55 26.15,1.81 USB1.B5
  Bottom Layer w0.127: v1(36.32,2.16) 34.91,3.57 28.72,3.57 28.58,3.43 v1(27.26,3.43)
$1N2158: length 55.5
  Top Layer w0.127: R1.1 34.37,2.16 v1(33.53,2.16) ; USB1.A9 26.79,4 v1(26.79,4.36)
  Top Layer w0.254: USB1.B9 24.15,1.67 24.51,1.31 24.58,1.31 24.75,1.15 24.75,1.07 C9.2 ; USB1.B9 24.15,3 ; USB1.B9 23.8,2.54 v1(23.37,2.54) ; v1(4.92,2.79) 4.92,3.39 5.39,3.87 U6.6 5.98,3.81 6.86,3.81 7.16,4.12 7.16,5.15 6.98,5.33 6.97,5.33 6.36,5.94 6.36,5.95 5.9,6.41 5.44,6.41 5.09,6.76 5.09,7.6 3.99,8.71 3.59,8.71 U5.1 ; 26.65,2.96 USB1.B4 ; 26.65,2.96 26.61,3 24.15,3 ; 26.65,2.96 USB1.A9 ; C6.1 2.88,5.97 v1(2.29,5.97) ; 24.15,3 USB1.A4
  Bottom Layer w0.127: v1(26.79,4.36) 26.74,4.31 26.74,3.21 27.47,2.48 28.76,2.48 29.08,2.16 v1(33.53,2.16)
  Bottom Layer w0.254: v1(2.29,5.97) 2.29,5.42 v1(4.92,2.79) 4.92,1.23 5.72,0.43 21.25,0.43 v1(23.37,2.54)
$1N2234: length 33.6
  Top Layer w0.127: v1(21.21,7.75) 21.21,7.13 19.76,5.68 U2.20
  Top Layer w0.254: U3.3 44.39,1.97 v1(44.7,2.29) ; v1(41.78,3.94) 41.58,3.73 R14.1
  Bottom Layer w0.127: v1(21.21,7.75) 24.79,7.75 25.06,8.01 32.5,8.01 38.48,2.03 39.88,2.03 v1(41.78,3.94)
  Bottom Layer w0.254: v1(44.7,2.29) 43.94,2.29 42.29,3.94 v1(41.78,3.94)
$1N2668: length 3.1
  Top Layer w0.127: U1.4 37.83,1.59 37.83,1.31 37.7,1.18 36.53,1.18 35.81,1.91 R1.2
$1N3088: length 13.9
  Top Layer w0.127: R13.2 10.79,5.92 10.79,5.97 10.84,6.01 12.46,6.01 12.52,6.08 13.07,6.08 13.34,6.35 13.34,6.61 13.71,6.99 15.62,6.99 15.75,6.86 15.75,5.85 14.35,4.46 14.35,3.82 v1(14.48,3.7)
  Bottom Layer w0.254: v1(14.48,3.7) 14.91,3.26 14.91,2.49 14.58,2.16 EN.1
$1N3093: length 5.2
  Top Layer w0.127: 12.52,5.68 14.06,5.68 v1(14.6,6.22)
  Bottom Layer w0.254: v1(14.6,6.22) 13.97,6.86 CLK.1
$1N3097: length 6.8
  Top Layer w0.127: 12.52,5.28 14.42,5.28 v1(14.48,5.33)
  Bottom Layer w0.254: MOSI.1 12.7,7.62 12.7,7.11 v1(14.48,5.33)
$1N3142: length 8.2
  Top Layer w0.127: v1(13.91,4.76) 13.79,4.88 12.52,4.88
  Bottom Layer w0.254: CS.1 9.78,8.89 v1(13.91,4.76)
$1N3146: length 6
  Top Layer w0.127: v1(10.85,4.77) 11.18,4.44 11.43,4.44 ; 12.52,4.48 12.49,4.44 11.43,4.44 ; R11.2 11.18,4.19 11.43,4.44
  Bottom Layer w0.127: ECIN.1 10.85,3.23 v1(10.85,4.77)
$1N3176: length 9.6
  Top Layer w0.127: R12.2 10.54,3.05 11.56,4.06 12.5,4.06 12.52,4.08 13.19,4.08 14.1,3.17 15.24,3.17 15.75,3.68 15.75,4.69 v1(15.6,4.84)
  Bottom Layer w0.127: v1(15.6,4.84) 16.36,4.84 DISP.1
$1N3199: length 10.3
  Top Layer w0.127: 12.52,3.68 11.97,3.68 11.71,3.41 11.71,2.86 11.3,2.46 ; 11.3,2.46 10.75,1.91 R9.2 ; 11.3,2.46 v1(11.3,1.78)
  Bottom Layer w0.127: EMOD.1 11.05,5.46 11.56,4.95 11.56,2.03 v1(11.3,1.78)
$1N3987: length 6.6
  Top Layer w0.127: v1(41.66,6.73) 41.28,6.35 R2.1
  Bottom Layer w0.127: v1(41.66,6.73) 43.05,6.73 44.7,8.39 44.7,8.76 D-.1
$1N3994: length 25.4
  Top Layer w0.127: v1(25.76,1.01) 25.15,1.63 USB1.B7 ; R2.2 38.48,6.15 v1(32.18,6.15) ; v1(26.16,4.81) 25.65,4.3 USB1.A7
  Bottom Layer w0.127: v1(25.76,1.01) 25.76,4.42 ; 25.76,4.42 25.41,4.06 24.13,4.06 23.88,4.32 23.88,5.72 24.64,6.48 31.85,6.48 v1(32.18,6.15) ; 25.76,4.42 v1(26.16,4.81)
$1N3997: length 10.1
  Top Layer w0.127: R3.1 40.77,5.08 v1(41.66,5.97)
  Bottom Layer w0.127: v1(41.66,5.97) 42.8,5.97 43.56,6.73 46.61,6.73 46.99,7.11 D+.1
$1N4004: length 24.7
  Top Layer w0.127: 25.95,5.33 26.56,5.33 27.78,4.11 27.78,3.21 27.24,2.68 27.24,1.58 26.98,1.32 26.32,1.32 26.09,1.55 25.91,1.55 25.65,1.81 USB1.B6 ; 25.95,5.33 25.15,4.53 25.15,3.86 USB1.A6 ; 25.95,5.33 25.07,5.33 v1(24.98,5.42) ; v1(33.53,5.08) R3.2
  Bottom Layer w0.127: v1(33.53,5.08) 32.51,5.08 31.34,6.25 25.81,6.25 v1(24.98,5.42)
$1N4388: length 35.7
  Top Layer w0.254: v1(18.67,7.87) 17.84,8.7 17.84,8.77 17.68,8.93 17.61,8.93 17.02,9.53 6.37,9.53 U5.6 U5.5
  Bottom Layer w0.254: VBUS.1 33.27,8.89 33.24,8.92 19.85,8.92 19.82,8.89 19.69,8.89 v1(18.67,7.87)
$1N4633: length 3.9
  Top Layer w0.254: 43.46,7.75 43.61,7.6 U3.1
$1N4870: length 2.8
  Top Layer w0.254: U3.4 46.68,1.97 47.42,2.72 R5.1 R6.2

## Copper pours and planes (outline as drawn; the poured copper is in the pictures)
GND on Top Layer: 0,10.16 50.8,10.16 50.8,0 0,0
GND on Bottom Layer: 0,10.16 50.8,10.16 50.8,0 0,0
